# EAGLE design sensorHubRev4 (EAGLE 9.2.2)
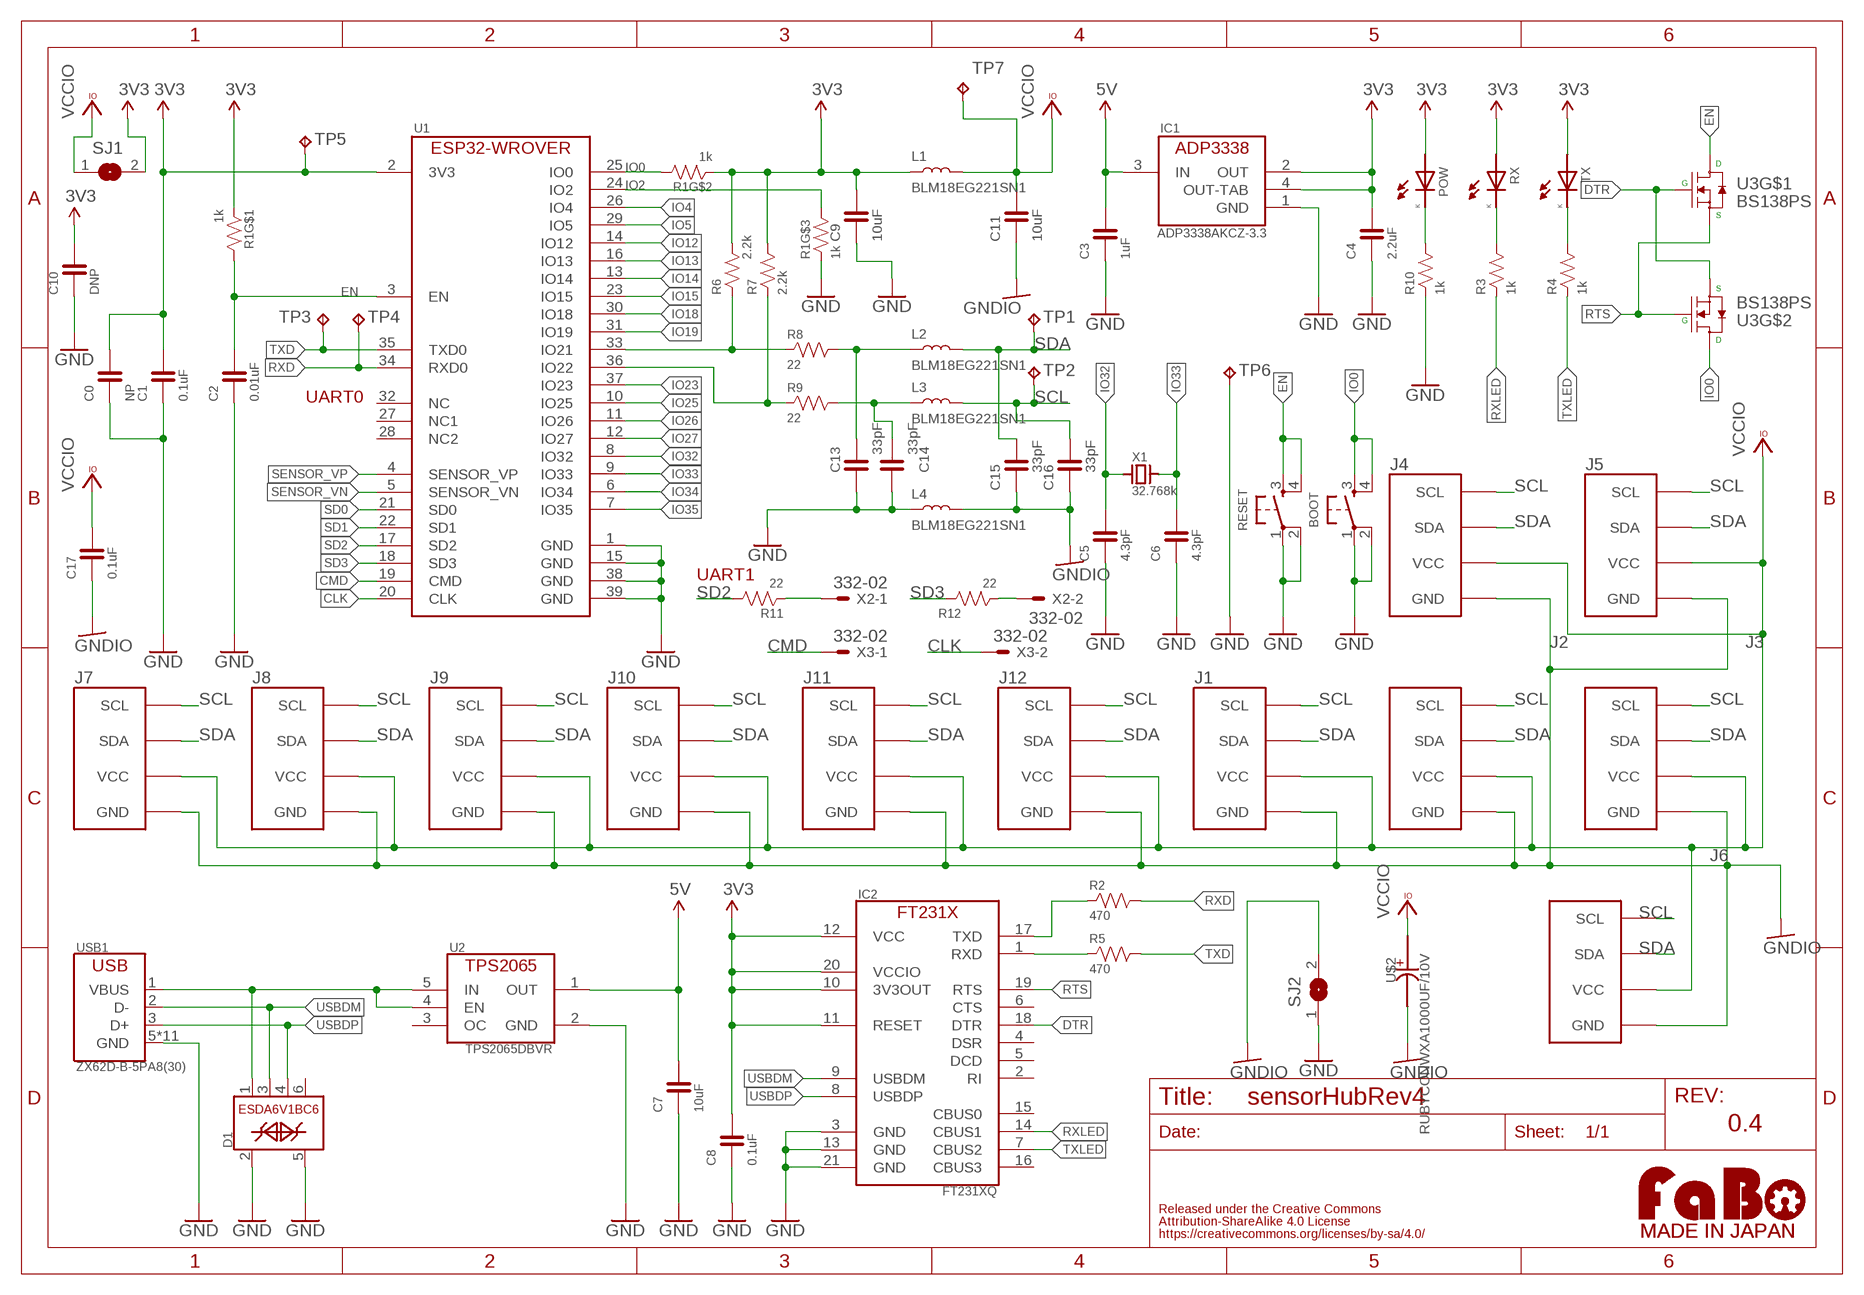
[diagram p0: schematic, sheet 1]

## Parts
BOOT  TACTILE-KMR2  [KMR2-TACT]
C0  NP  CAPACITOR-M  [MULTIPAD0603]
C1  0.1uF  CAPACITOR-0603  [EIA0603]
C2  0.01uF  CAPACITOR-0603  [EIA0603]
C3  1uF  CAPACITOR-0603  [EIA0603]
C4  2.2uF  CAPACITOR-0603  [EIA0603]
C5  4.3pF  CAPACITOR-0603  [EIA0603]
C6  4.3pF  CAPACITOR-0603  [EIA0603]
C7  10uF  CAPACITOR-0603  [EIA0603]
C8  0.1uF  CAPACITOR-0603  [EIA0603]
C9  10uF  CAPACITOR-0603_NARROW  [0603-NARROW]
C10  DNP  CAPACITOR-0603  [EIA0603]
C11  10uF  CAPACITOR-0603_NARROW  [0603-NARROW]
C13  33pF  CAPACITOR-0603_NARROW  [0603-NARROW]
C14  33pF  CAPACITOR-0603_NARROW  [0603-NARROW]
C15  33pF  CAPACITOR-0603_NARROW  [0603-NARROW]
C16  33pF  CAPACITOR-0603_NARROW  [0603-NARROW]
C17  0.1uF  CAPACITOR-0603  [EIA0603]
D1  ESDA6V1BC6  [SOT-23-6L]
IC1  ADP3338AKCZ-3.3  ADP3338AKCZ  [SOT-223-KC3]
IC2  FT231XQ  [QFN-20]
J1  FABO_BRICK_I2C-S04B-PASK-2  [FABO_BRICK_I2C_S04B-PASK-2]
J2  FABO_BRICK_I2C-S04B-PASK-2  [FABO_BRICK_I2C_S04B-PASK-2]
J3  FABO_BRICK_I2C-S04B-PASK-2  [FABO_BRICK_I2C_S04B-PASK-2]
J4  FABO_BRICK_I2C-S04B-PASK-2  [FABO_BRICK_I2C_S04B-PASK-2]
J5  FABO_BRICK_I2C-S04B-PASK-2  [FABO_BRICK_I2C_S04B-PASK-2]
J6  FABO_BRICK_I2C-S04B-PASK-2  [FABO_BRICK_I2C_S04B-PASK-2]
J7  FABO_BRICK_I2C-S04B-PASK-2  [FABO_BRICK_I2C_S04B-PASK-2]
J8  FABO_BRICK_I2C-S04B-PASK-2  [FABO_BRICK_I2C_S04B-PASK-2]
J9  FABO_BRICK_I2C-S04B-PASK-2  [FABO_BRICK_I2C_S04B-PASK-2]
J10  FABO_BRICK_I2C-S04B-PASK-2  [FABO_BRICK_I2C_S04B-PASK-2]
J11  FABO_BRICK_I2C-S04B-PASK-2  [FABO_BRICK_I2C_S04B-PASK-2]
J12  FABO_BRICK_I2C-S04B-PASK-2  [FABO_BRICK_I2C_S04B-PASK-2]
L1  BLM18EG221SN1  INDUCTOR-0603  [0603]
L2  BLM18EG221SN1  INDUCTOR-0603  [0603]
L3  BLM18EG221SN1  INDUCTOR-0603  [0603]
L4  BLM18EG221SN1  INDUCTOR-0603  [0603]
LOGO1  LOGO_FABO-M_BOTTOM  [LOGO_FABO_M_BOTTOM]
POW  LED-0603  [LED_0603]
R1  1k  RESISTOR_ARRAY  [EXBV8V]
R2  470  RESISTOR-0603  [EIA0603]
R3  1k  RESISTOR-0603  [EIA0603]
R4  1k  RESISTOR-0603  [EIA0603]
R5  470  RESISTOR-0603  [EIA0603]
R6  2.2k  RESISTOR-0603  [EIA0603]
R7  2.2k  RESISTOR-0603  [EIA0603]
R8  22  RESISTOR-0603  [EIA0603]
R9  22  RESISTOR-0603  [EIA0603]
R10  1k  RESISTOR-0603  [EIA0603]
R11  22  RESISTOR-0603  [EIA0603]
R12  22  RESISTOR-0603  [EIA0603]
RESET  TACTILE-KMR2  [KMR2-TACT]
RX  LED-0603  [LED_0603]
SJ1  SJ  [SJ]
SJ2  SJ  [SJ]
TP1  TPB1,27  [B1,27]
TP2  TPB1,27  [B1,27]
TP3  TPB1,27  [B1,27]
TP4  TPB1,27  [B1,27]
TP5  TPB1,27  [B1,27]
TP6  TPB1,27  [B1,27]
TP7  TPB1,27  [B1,27]
TX  LED-0603  [LED_0603]
U1  ESP32-WROVER-B  [ESP32-WROVER-B]
U2  TPS2065DBVR  TPS2065DBV  [SOT-23-5]
U3  BS138PS  [SOT-363]
U$2  RUBYCONWXA1000UF/10V  [ALUMINUM10*9]
USB1  ZX62D-B-5PA8(30)  USB-ZX62D  [ZX62D-B-5PA8]
X1  32.768k  CRYSTAL-ABS07  [ABS07]
X2  332-02  [332-02]
X3  332-02  [332-02]

## Nets
3V3: C0.2 C1.2 C4.2 C8.2 C9.2 C10.2 IC1.2(OUT) IC1.4(OUT-TAB) IC2.10(3V3OUT) IC2.11(RESET) IC2.12(VCC) IC2.20(VCCIO) L1.1 POW.A(ANODE) R1.1 R1.2 R6.2 R7.2 RX.A(ANODE) SJ1.2 TP5.TP TX.A(ANODE) U1.2(3V3)
5V: C3.2 C7.2 IC1.3(IN) U2.1(OUT)
CLK: U1.20(CLK) X3.2
CMD: U1.19(CMD) X3.1
DTR: IC2.18(DTR) U3.2(G) U3.4(S)
EN: C2.2 R1.8 RESET.3 RESET.4 U1.3(EN) U3.6(D)
GND: BOOT.1 BOOT.2 C0.1 C1.1 C2.1 C3.1 C4.1 C5.1 C6.1 C7.1 C8.1 C9.1 C10.1 C13.1 C14.1 D1.2 D1.5 IC1.1(GND) IC2.3(GND) IC2.13(GND) IC2.21(GND) L4.1 R1.3 R10.1 RESET.1 RESET.2 SJ2.1 TP6.TP U1.1(GND) U1.15(GND) U1.38(GND) U1.39(GND) U2.2(GND) USB1.5(GND) USB1.B1(GND) USB1.B2(GND) USB1.B3(GND) USB1.B4(GND) USB1.T1(GND) USB1.T2(GND) USB1.T3(GND) USB1.T4(GND) USB1.T5(GND) USB1.T6(GND)
GNDIO: C11.1 C15.1 C16.1 C17.1 J1.GND J2.GND J3.GND J4.GND J5.GND J6.GND J7.GND J8.GND J9.GND J10.GND J11.GND J12.GND L4.2 SJ2.2 U$2.MINUS(-)
IO0: BOOT.3 BOOT.4 R1.7 U1.25(IO0) U3.3(D)
IO2: R1.6 U1.24(IO2)
IO4: U1.26(IO4)
IO5: U1.29(IO5)
IO12: U1.14(IO12)
IO13: U1.16(IO13)
IO14: U1.13(IO14)
IO15: U1.23(IO15)
IO18: U1.30(IO18)
IO19: U1.31(IO19)
IO23: U1.37(IO23)
IO25: U1.10(IO25)
IO26: U1.11(IO26)
IO27: U1.12(IO27)
IO32: C5.2 U1.8(IO32) X1.1
IO33: C6.2 U1.9(IO33) X1.2
IO34: U1.6(IO34)
IO35: U1.7(IO35)
LED1K: POW.K(CATHODE) R10.2
LED2K1: R3.2 RX.K(CATHODE)
LED2K2: R4.2 TX.K(CATHODE)
N$1: IC2.1(RXD) R5.1
N$2: R11.1 X2.1
N$3: IC2.17(TXD) R2.1
N$4: R12.1 X2.2
N$5: R6.1 R8.1 U1.33(IO21)
N$6: R7.1 R9.1 U1.36(IO22)
N$7: C13.2 L2.1 R8.2
N$8: C14.2 L3.1 R9.2
RTS: IC2.19(RTS) U3.1(S) U3.5(G)
RXD: R2.2 TP4.TP U1.34(RXD0)
RXLED: IC2.14(CBUS1) R3.1
SCL: C16.2 J1.SCL J2.SCL J3.SCL J4.SCL J5.SCL J6.SCL J7.SCL J8.SCL J9.SCL J10.SCL J11.SCL J12.SCL L3.2 TP2.TP
SD0: U1.21(SD0)
SD1: U1.22(SD1)
SD2: R11.2 U1.17(SD2)
SD3: R12.2 U1.18(SD3)
SDA: C15.2 J1.SDA J2.SDA J3.SDA J4.SDA J5.SDA J6.SDA J7.SDA J8.SDA J9.SDA J10.SDA J11.SDA J12.SDA L2.2 TP1.TP
SENSOR_VN: U1.5(SENSOR_VN)
SENSOR_VP: U1.4(SENSOR_VP)
TXD: R5.2 TP3.TP U1.35(TXD0)
TXLED: IC2.7(CBUS2) R4.1
USBDM: D1.3 IC2.9(USBDM) USB1.2(D-)
USBDP: D1.4 IC2.8(USBDP) USB1.3(D+)
USBVBUS: D1.1 U2.4(EN) U2.5(IN) USB1.1(VBUS)
VCCIO: C11.2 C17.2 J1.VCC J2.VCC J3.VCC J4.VCC J5.VCC J6.VCC J7.VCC J8.VCC J9.VCC J10.VCC J11.VCC J12.VCC L1.2 SJ1.1 TP7.TP U$2.PLUS(+)
Unconnected: D1.6 IC2.2(RI) IC2.4(DSR) IC2.5(DCD) IC2.6(CTS) IC2.15(CBUS0) IC2.16(CBUS3) R1.4 R1.5 U1.27(NC1) U1.28(NC2) U1.32(NC) U2.3(OC)

## Notes on the sheet
- UART0
- UART1
- 0.4

## Library data of the parts
BOOT RESET = component:TACTILE
C0 C1-C8 C10 C17 = component:CAPACITOR
C9 C11 C13-C16 = FaBo-Capacitor:CAPACITOR: CAPACITOR
D1 = component:ESDA6V1BC6
IC1 = component:ADP3338AKCZ
IC2 = component:FT231X
J1-J12 = FaBo-Template:FABO_BRICK_I2C: FaBo Brick I2C
L1-L4 = FaBo-Inductor:INDUCTOR: RESISTOR
LOGO1 = component:LOGO_FABO
POW RX TX = component:LED
R1 = component:RESISTOR_ARRAY
R2-R12 = component:RESISTOR
SJ1 SJ2 = jumper:SJ: SMD solder JUMPER
TP1-TP7 = testpad:TP: Test pad
U1 = component:ESP32-WROVER-B
U2 = component:TPS2065
U3 = component:BS138PS
U$2 = FaBo-Capacitor:RUBYCONWXA1000UF/10V
USB1 = component:USB
X1 = component:CRYSTAL
X2 X3 = con-garry:332-02: 2 Pin - 2mm Dual Row Source: www.mpe-connector.de / garry_shortform_2012.pdf

## Board
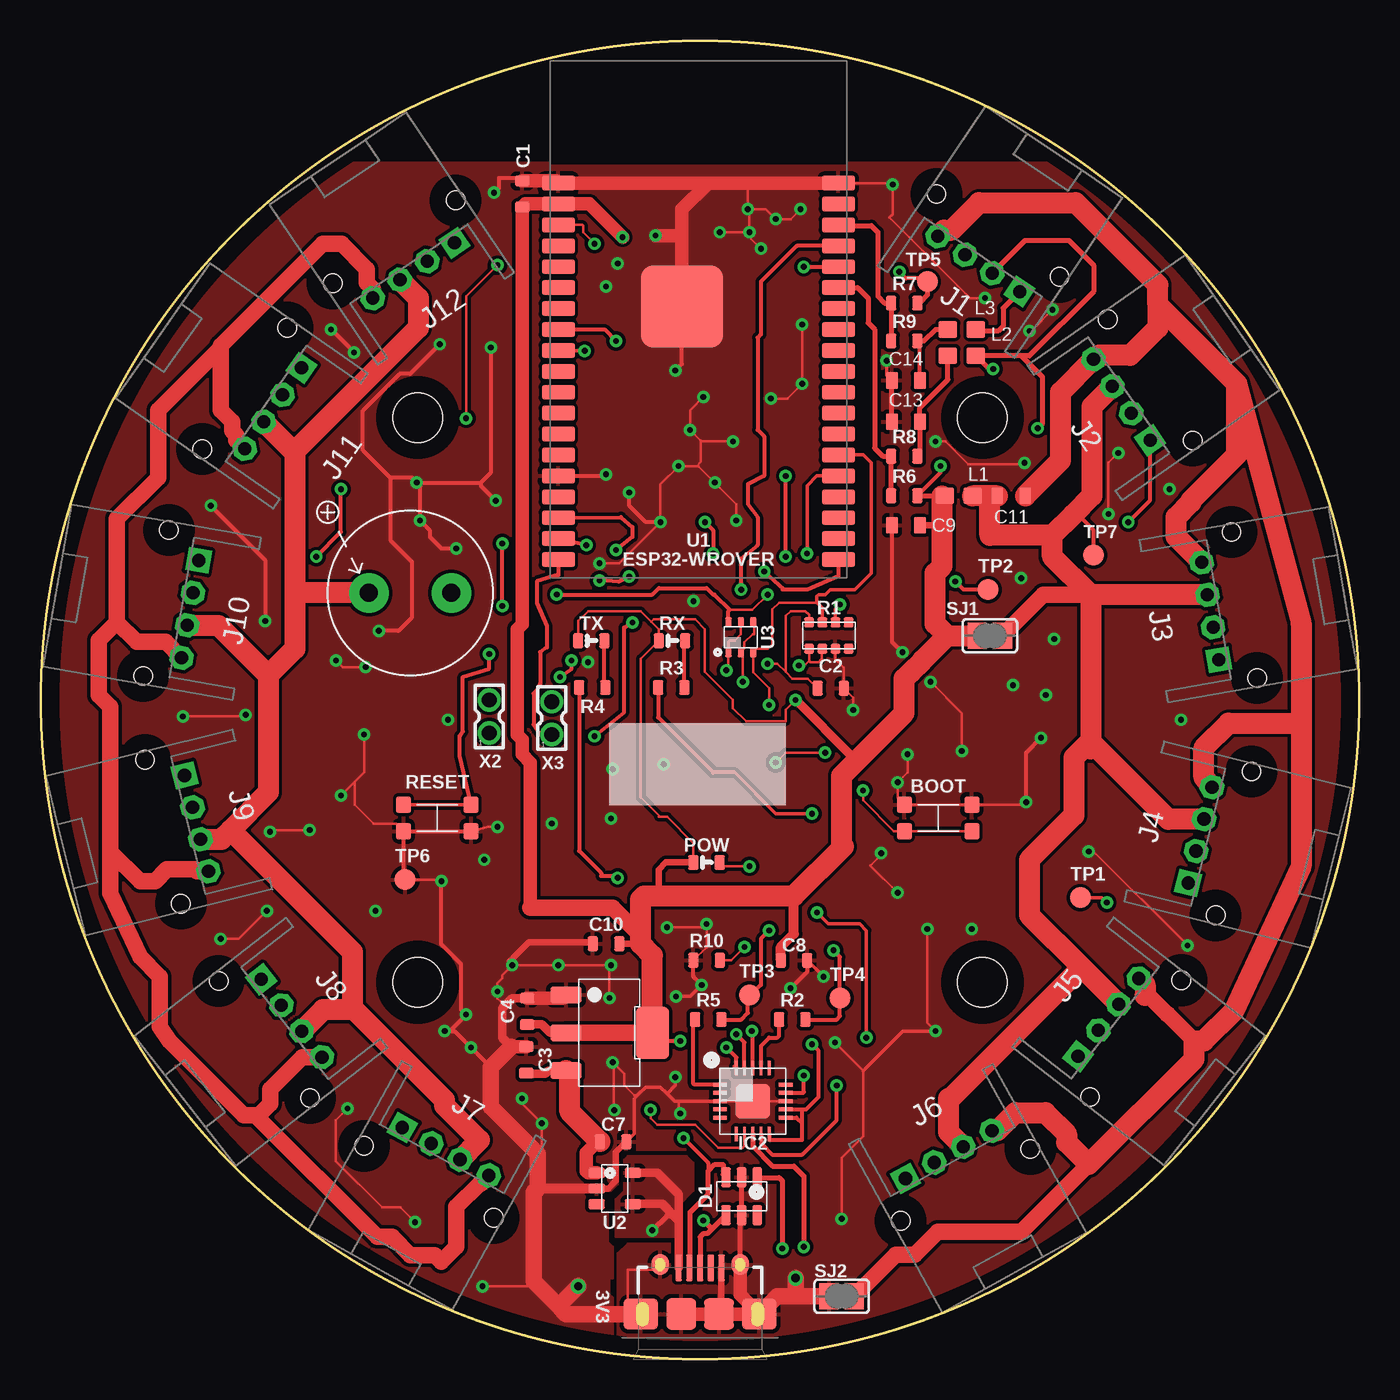
[diagram p1: board, top side]
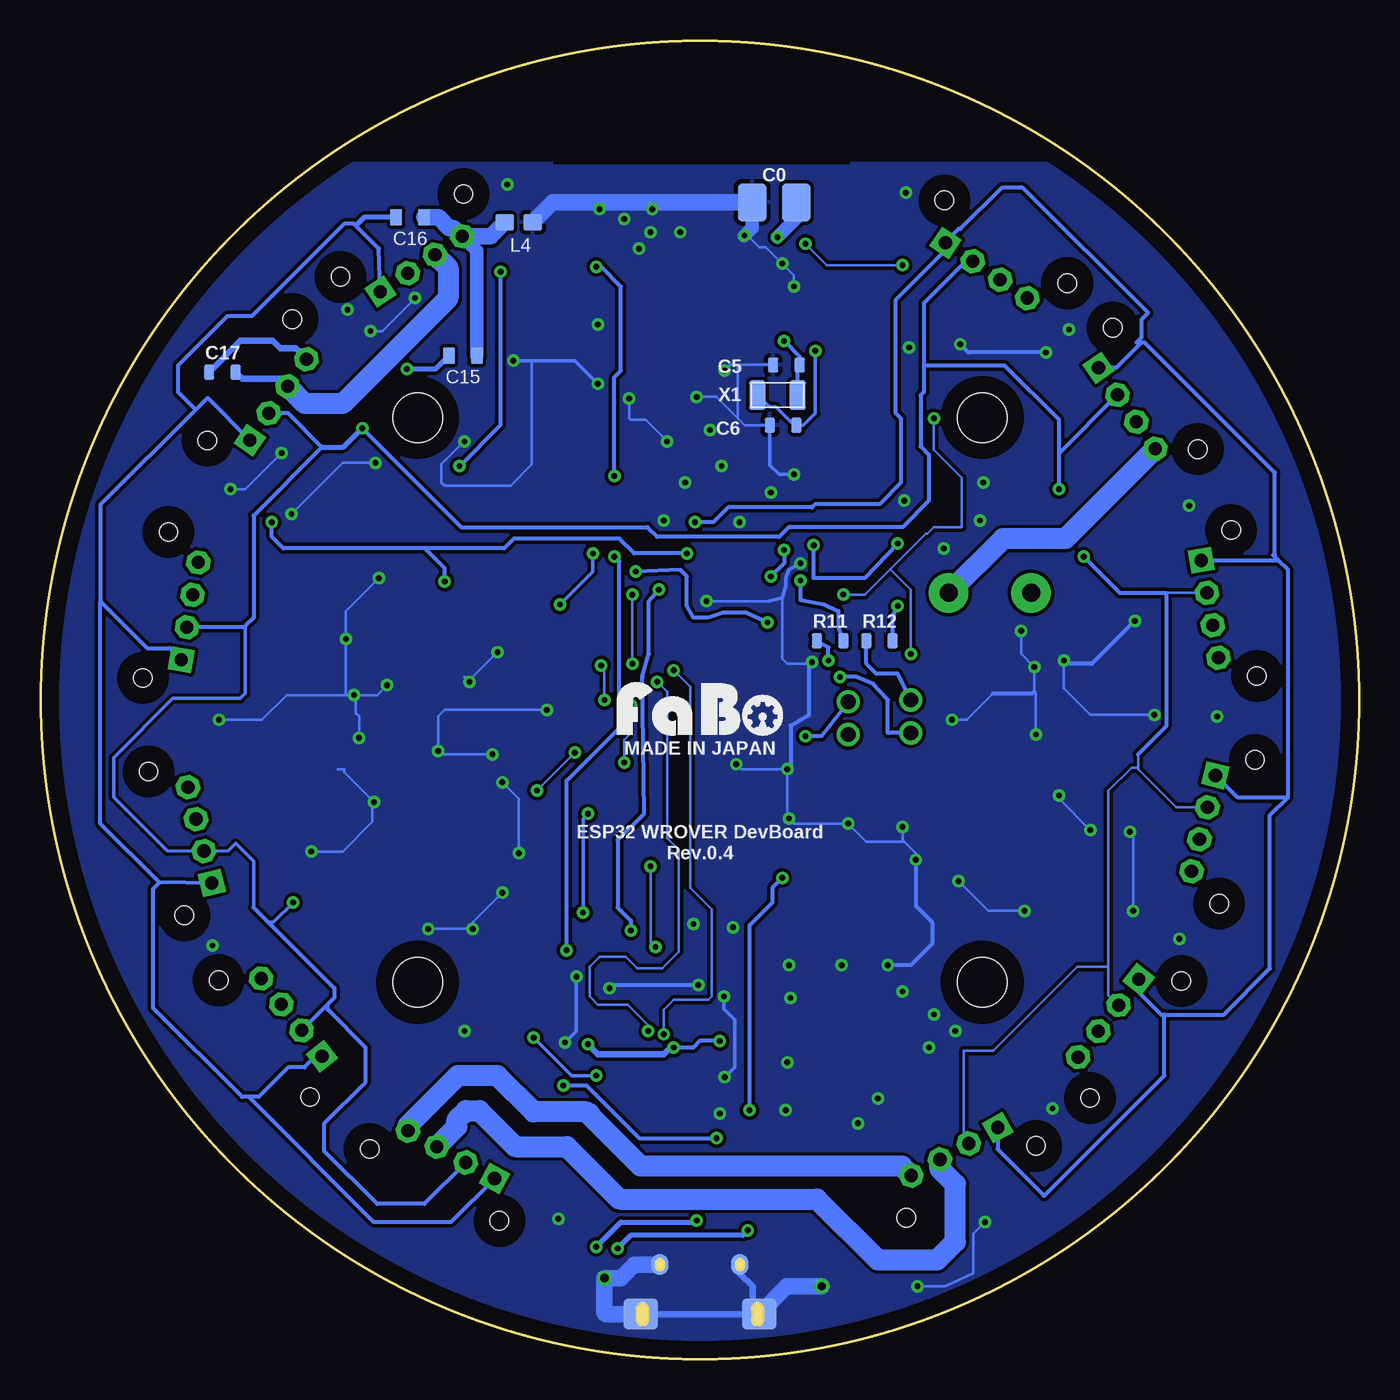
[diagram p2: board, bottom side, seen from below]

Size 80 x 80 mm. Coordinates in mm from the lower left corner, seen from the top.
Outline: circle at 40,40 radius 40
Copper layers (1*16): Top 0.035mm / dielectric 1.5mm / Bottom 0.035mm
Design rules "PCBway": minimum track width 6mil, minimum drill 0.3mm, track to track 0.205mm, track to pad 0.205mm, pad to pad 0.205mm, via to via 0.205mm, smd to smd 8mil, copper to edge 40mil, drill to drill 8mil, minimum pad ring 10mil, minimum via ring 8mil, stop-mask expansion 4mil, vias tented up to drill 25mil, thermal gap 10mil
Holes 3 mm at 22.86,57.15 22.86,22.86 57.15,22.86 57.15,57.15
tRestrict: area 15.5,72.7 to 65.1,83.6
bRestrict: area 15.5,72.7 to 65.1,83.6

### Footprints (pad centres in the part's own frame; a part is rotated, then mirrored left to right if it is on the bottom)
KMR2-TACT = smd 0.9 x 1: 1 -2.05,0.8; 2 2.05,0.8; 3 2.05,-0.8; 4 -2.05,-0.8
MULTIPAD0603 = smd 1.725 x 2.3: 1 -1.337,0; 2 1.337,0
EIA0603 = smd 0.65 x 0.9: 1 -0.8,0; 2 0.8,0
0603-NARROW = smd 0.71 x 1: 1 -0.85,0; 2 0.85,0
SOT-23-6L = smd 0.6 x 1.2: 1 -0.95,-1.15; 2 0,-1.15; 3 0.95,-1.15; 4 0.95,1.15; 5 0,1.15; 6 -0.95,1.15
SOT-223-KC3 = smd 1 x 1.9: 1 -2.3,-2.625; 2 0,-2.625; 3 2.3,-2.625 | smd 3.15 x 2: 4 0,2.625
QFN-20 = smd 0.9 x 0.25: 1 -2,1; 2 -2,0.5; 3 -2,0; 4 -2,-0.5; 5 -2,-1; 11 2,-1; 12 2,-0.5; 13 2,0; 14 2,0.5; 15 2,1 | smd 0.25 x 0.9: 6 -1,-2; 7 -0.5,-2; 8 0,-2; 9 0.5,-2; 10 1,-2; 16 1,2; 17 0.5,2; 18 0,2; 19 -0.5,2; 20 -1,2 | smd 2.1 x 2.1: 21 0,0
FABO_BRICK_I2C_S04B-PASK-2 = drill 0.8 pad 1.422 octagon: GND -3,0; SDA 1,0; VCC -1,0 | drill 0.8 pad 1.422 square: SCL 3,0 | hole 1.1: 4.5,2.1; -4.5,2.1
0603 = smd 1.1 x 1: 1 -0.85,0; 2 0.85,0
LED_0603 = smd 0.65 x 0.9: A -0.8,0; K 0.8,0
EXBV8V = smd 0.6 x 0.6: 1 -1.2,-0.8; 2 -0.4,-0.8; 3 0.4,-0.8; 4 1.2,-0.8; 5 1.2,0.8; 6 0.4,0.8; 7 -0.4,0.8; 8 -1.2,0.8
SJ = smd 1.168 x 1.6: 1 -0.762,0; 2 0.762,0
B1,27 = smd 1.27 x 1.27: TP 0,0
ESP32-WROVER-B = smd 2 x 0.9: 1 -8.5,8.26; 2 -8.5,6.99; 3 -8.5,5.72; 4 -8.5,4.45; 5 -8.5,3.18; 6 -8.5,1.91; 7 -8.5,0.64; 8 -8.5,-0.63; 9 -8.5,-1.9; 10 -8.5,-3.17; 11 -8.5,-4.44; 12 -8.5,-5.71; 13 -8.5,-6.98; 14 -8.5,-8.25; 15 -8.5,-9.52; 16 -8.5,-10.79; 17 -8.5,-12.06; 18 -8.5,-13.33; 19 -8.5,-14.6; 20 8.5,-14.6; 21 8.5,-13.33; 22 8.5,-12.06; 23 8.5,-10.79; 24 8.5,-9.52; 25 8.5,-8.25; 26 8.5,-6.98; 27 8.5,-5.71; 28 8.5,-4.44; 29 8.5,-3.17; 30 8.5,-1.9; 31 8.5,-0.63; 32 8.5,0.64; 33 8.5,1.91; 34 8.5,3.18; 35 8.5,4.45; 36 8.5,5.72; 37 8.5,6.99; 38 8.5,8.26 | smd 5 x 5: 39 -1,0.76
SOT-23-5 = smd 0.6 x 1: 1 -0.95,-1.1; 2 0,-1.1; 3 0.95,-1.1; 4 0.95,1.1; 5 -0.95,1.1
SOT-363 = smd 0.6 x 0.4: 1 -0.9,0.75; 2 -0.9,0; 3 -0.9,-0.75; 4 0.9,-0.75; 5 0.9,0; 6 0.9,0.75
ALUMINUM10*9 = drill 1.1 pad 2.4: MINUS 2.5,0; PLUS -2.5,0
ZX62D-B-5PA8 = smd 0.4 x 1.6: 1 -1.3,4.25; 2 -0.65,4.25; 3 0,4.25; 4 0.65,4.25; 5 1.3,4.25 | smd 1.05 x 1.25 bottom: B1 -2.425,4.45; B2 2.425,4.45 | smd 2.1 x 1.9 bottom: B3 -3.6,1.45; B4 3.6,1.45 | smd 1.05 x 1.25: T1 -2.425,4.45; T2 2.425,4.45 | smd 2.1 x 1.9: T3 -3.6,1.45; T6 3.6,1.45 | smd 1.8 x 1.9: T4 -1.15,1.45; T5 1.15,1.45
ABS07 = smd 1 x 1.8: 1 -1.225,0; 2 1.225,0
332-02 = drill 0.9 pad 1.27: 1 0,-1; 2 0,1

### Placement (x,y rotation side)
BOOT  54.46,32.84 0 top
C0  35.49,70.21 0 bottom
C1  29.21,70.72 270 top
C2  47.94,40.71 180 top
C3  29.45,18.15 270 top
C4  29.5,21.09 270 top
C5  34.76,60.34 0 bottom
C6  34.95,56.68 0 bottom
C7  34.73,13.18 180 top
C8  45.7,24.19 180 top
C9  52.5,50.6 0 top
C10  34.3,25.2 0 top
C11  58.9,52.4 180 top
C13  52.5,56.9 0 top
C14  52.5,59.4 0 top
C15  54.4,60.9 180 bottom
C16  57.6,69.3 180 bottom
C17  69,59.9 0 bottom
D1  42.53,9.88 180 top
IC1  34.49,19.8 270 top
IC2  43.2,15.64 0 top
J1  56.92,66.47 326 top
J2  65.61,58.23 305 top
J3  70.98,45.4 280 top
J4  70.36,31.8 256 top
J5  64.8,20.73 232 top
J6  55.1,12.4 209 top
J7  24.55,12.59 151 top
J8  15.2,20.68 128 top
J9  9.43,32.51 104 top
J10  9.04,45.52 80 top
J11  14.08,57.71 55 top
J12  22.61,66.08 34 top
L1  55.7,52.4 0 top
L2  55.9,60.9 0 top
L3  55.9,62.5 0 top
L4  51,69 180 bottom
LOGO1  40.01,37.47 0 top
POW  40.4,30.14 0 top
R1  47.83,43.91 0 top
R2  45.6,20.6 0 top
R3  38.26,40.76 0 top
R4  33.46,40.76 0 top
R5  40.5,20.6 0 top
R6  52.4,52.4 0 top
R7  52.4,64.1 0 top
R8  52.4,54.8 0 top
R9  52.4,61.8 0 top
R10  40.4,24.2 0 top
R11  32.1,43.6 0 bottom
R12  29.1,43.6 0 bottom
RESET  24.05,32.84 180 top
RX  38.3,43.6 0 top
SJ1  57.6,43.9 180 top
SJ2  48.6,3.8 0 top
TP1  63.1,28 0 top
TP2  57.5,46.7 0 top
TP3  43,22.1 0 top
TP4  48.5,21.9 0 top
TP5  53.8,65.4 0 top
TP6  22.1,29.1 0 top
TP7  63.9,48.8 0 top
TX  33.4,43.6 0 top
U1  39.91,63.12 0 top
U2  34.83,10.34 270 top
U3  42.48,43.81 90 top
U$2  22.4,46.5 0 top
USB1  40.01,1.27 0 top
X1  35.3,58.51 180 bottom
X2  27.2,39 0 top
X3  31,38.9 0 top

### Tracks (layer width: path | path; a pad name or v marks a point on that pad's centre or on a via)
3V3  (via drill 0.35)
  Top 0.152: POW.A 39.59,31.3 38,32.9 37.6,32.9 | 37.6,32.9 37.5,32.9 | 37.6,32.9 36.4,34.1 36.4,42.5 RX.A 37.5,44.3 37.05,44.75 | TX.A 32.6,44.8 33.2,45.4 36.4,45.4 37.05,44.75 | R1.1 46.62,42.38 | 46.62,42.38 46.7,42.3 47.2,42.3 47.4,42.5 47.4,43.09 R1.2 | 46.62,42.38 46.35,42.1 v46,42.1 | 37.05,44.75 37.2,44.9 39.7,44.9 40.3,44.3 40.3,41.7 42,40 42,39.5 42.8,38.7 45.2,38.7 45.2,39.4 v45.8,40
  Top 0.254: IC1.4 37.61,19.3 v38.8,19.3 | 42.1,17.75 IC2.20 42.2,18.3 v41.6,18.9 | IC2.12 46.3,15.14 | 46.3,15.14 46.45,15.14 47.2,15.9 47.2,18.7 v46.8,19.1 | IC2.10 44.2,13.3 46.2,13.3 46.2,14.3 | 46.2,14.3 46.2,15.04 46.3,15.14 | IC2.11 45.85,14.64 46.2,14.3 | R6.2 54.6,53.8 v54.6,54.2 | 54,65.6 52.5,65.6 v52.1,66
  Top 0.305: 54,65.6 TP5.TP 53.8,64.6 53.3,64.1 R7.2 | R6.2 54.7,52.4 L1.1 | 49.25,36.55 49.25,36.05
  Top 0.406: C9.2 54.7,50.6 | C8.2 45.01,24.19 | POW.A 37.94,30.14 37.5,29.7 37.5,28.1 | C10.2 36.4,25.2
  Top 0.508: IC1.2 30.91,19.8 30.4,20.3 C4.2 | v45.8,40 49.25,36.55 49.75,36.55
  Top 0.61: C8.2 44.91,25 45.7,25.8 45.7,28.1
  Top 0.813: v35.3,68.1 33.28,70.11 U1.2 29.41,70.11 C1.2 29.2,44.6 28.9,44.3 28.9,37.9 29.2,37.6 29.2,36.7 29.7,36.2 29.7,27.4
  Top 1.016: IC1.4 IC1.2 | 29.7,27.4 34.7,27.4 36.4,25.7
  Top 1.27: IC1.4 37.12,24.48 36.4,25.2 36.4,25.7 36.4,27.9 36.6,28.1 37.5,28.1 45.7,28.1 48.7,31.1 48.6,31.2 48.6,35.4 49.75,36.55 52.4,39.2 52.4,41.3 52.78,41.68 52.8,41.68 53.52,42.4 53.52,42.42 55,43.9 | 55,43.9 SJ1.2 | 54.7,52.4 54.7,50.6 54.7,48.12 54.28,47.7 54.28,44.62 55,43.9
  Bottom 0.152: v46,42.1 45.8,41.9 v45.8,40
  Bottom 0.254: v38.8,19.3 40,19.3 40.4,18.9 v41.6,18.9 | v54.6,54.2 52.1,56.7 v52.1,66
  Bottom 0.406: v41.6,18.9 41.8,18.9 42.2,18.5 46.2,18.5 v46.8,19.1
  Bottom 0.813: v35.3,68.1 34.16,69.24 C0.2
5V
  Top 0.508: 31.9,17.46 IC1.3 30.8,17.5 30.6,17.3 29.5,17.3 C3.2
  Top 0.813: 31.7,17.33 IC1.3 | U2.1 33.21,11.29 33.1,11.4 33.1,12.5 33.78,13.18 C7.2
  Top 1.27: C7.2 32.1,15.01 32.1,17.26 IC1.3
CLK  (via drill 0.35)
  Top 0.254: U1.20 48.4,47.5 46.5,46.7 45.1,46.7 | 45.1,46.7 45,46.7 | 45.1,46.7 v43.9,47.8 | v33.59,37.8 35.4,39.26 35.4,44.4 v35.9,44.7
  Bottom 0.254: X3.2 32.63,37.8 v33.59,37.8 | v35.9,44.7 37.2,45.3 38.6,45.3 39.5,45 40.4,45 40.8,45.7 40.8,47.5 41.2,47.9 v43.9,47.8
CMD
  Top 0.254: U1.19 31.4,47.6 30.1,47.2 30.1,45.9 30.7,44.5 30.7,43.2 30.3,42.9 30.3,41 30.1,40.6 29.9,40.4 29.9,38.5 30.3,37.9 X3.1
DTR  (via drill 0.35)
  Top 0.152: 43.2,19.84 v43.15,19.9 | v42.6,41.1 42.6,42.79 U3.2 42.7,43.13 42.7,43.5 43.2,44 43.3,44 43.3,44.64 U3.4
  Top 0.254: IC2.18 43.2,19.84
  Bottom 0.152: v43.15,19.9 43.15,20.25 44.4,21.5 46.2,21.5 46.7,22 46.7,23.8 46.1,24.4 44.5,24.4 43.8,23.7 42.3,23.7 41.3,24.7 41.3,30.9 42,31.6 42,40.5 v42.6,41.1
EN  (via drill 0.35)
  Top 0.152: v25.8,57.1 25.8,64.5 v27.7,66.4 | v33.6,67.7 32.9,68.4 32.9,68.8 32.85,68.84 U1.3 | C2.2 46.55,41.3 45.6,41.3 45.2,41.7 | R1.8 46.62,45.17 46.4,45.4 45.5,45.4 45.2,45.1 45.2,41.7 | 45.2,41.7 44.7,42.2 v44.1,42.2 | v44.11,46.39 43.18,45.47 41.8,45.47 41.73,45.47
  Top 0.203: RESET.3 RESET.4
  Top 0.254: RESET.4 25.4,36.6 25.4,37.8 25.6,38.1 25.6,41.4 27.2,41.9 v27.2,42.8 | v31.3,46.4 37.1,46.4 37.5,46.8 40.4,46.8 40.8,46.4 40.87,46.4 41.8,45.47 41.73,45.4 U3.6
  Bottom 0.152: v31.3,46.4 30,46.4 28.45,47.95 | v25.8,57.1 25.8,55.2 24.1,53.5 24.1,50.5 25.8,50.5 26.2,50.1 26.3,50.1 28.45,47.95 | v27.7,66.4 32.3,66.4 v33.6,67.7 | v27.2,42.8 27.2,46.7 28.45,47.95 | v44.1,42.2 v44.1,46.39 v44.11,46.39
GND  (via drill 0.35, 0.5)
  Top 0.152: v59.8,33.8 59.65,33.65 BOOT.2 BOOT.1 52,34.05 v52,35 52.6,35.6 v52.6,36.7 | R1.3 48.23,42.48 48.74,41.96 C2.1 49.3,40.15 v49.3,39.4 | v19.6,37.9 19.6,35.6 19.05,35.05 | USB1.T3 35.6,3.52 35.6,5.4 37.26,5.4 USB1.T1 | IC2.3 IC2.21 IC2.13 | v41.2,68.4 v43,68.4 | v43,68.4 43,69.7 v42.9,69.8 | v42.9,69.8 42.9,71.39 | v42.9,69.8 44,69.8 v44.6,69.2 45.5,69.2 v46.1,69.8 | v43,68.4 43,68.1 v43.7,67.4 | v46.2,62.8 v46.2,59.2 45.3,58.3 v44.3,58.3 | v42,55.7 40.1,55.7 40.05,55.75 | 40.05,55.75 v39.4,56.4 39.4,57.6 v40.2,58.4 | 39.8,54.2 v38.7,54.2 37.6,53.1 v37.6,50.8 35.1,48.3 v33.9,48.3 | 39.8,54.2 39.9,54.2 v40.9,53.2 42.2,51.9 v42.2,50.9 | 39.8,54.2 40.05,54.45 40.05,55.75 | RESET.1 27.14,32.3 v27.7,32.3 | v24.3,29 24.2,29.1 TP6.TP | v18.2,34.2 19.05,35.05 | v17.9,42.4 18.3,42 v19.7,42 | v52,28.3 50.35,29.95 51,30.6 v51,30.7 | R10.1 40.4,25 v40.4,26.4 40.2,26.2 v38,26.2 | v34.5,21.9 34.5,23.8 v34.6,23.9 v31.4,23.9 v28.6,23.9 28.45,23.75 28,23.3 28,23.1 27.7,22.8 v27.7,22.3 27.7,21.9 28,21.6 28,21.3 | v34.7,18 34.75,17.95 | 34.75,17.95 35.4,17.3 35.4,16.6 36,16 36.2,16 | v34.8,15.1 34.75,15.15 34.75,17.95 | v29.2,15.8 29.2,15.5 v30.4,14.3 30.4,10.34 | v48.2,19.2 49.9,17.5 49.9,13.5 48.6,12.2 v48.6,8.5 | v54.3,19.9 53.8,20.4 v53.8,26.1 | v38.8,14.9 38.7,15 38.7,15.64 | v54,41.1 55.9,39.2 v55.9,36.9 | U1.38 51.62,71.39 v51.7,71.3 51.7,69.5 51.5,69.3 56.4,64.4 v57.3,64.4 | v61.4,63.7 60.1,62.4 v60,62.4 | v65.4,55 64.8,54.4 v64.8,51.3 | v59.7,54.4 59.6,54.3 56.3,54.3 54.9,55.7 v54.3,55.7 | v69.6,25.1 63.9,30.8 v63.6,30.8 | v18.6,15.2 17.9,14.5 17.9,12 20.7,9.2 21.8,9.2 v22.7,8.3 | v26.8,4.4 29.6,4.4 29.9,4.7
  Top 0.152: v10.9,25.5 12,25.5 v13.7,27.2 | v13.9,32 14,32.1 v16.3,32.1 | v8.6,39 12.31,39 v12.41,39.1 | RESET.2 21.55,32.5 20.2,32.5 19.05,33.65 19.05,35.05
  Top 0.203: C7.1 36,13.65 36,15.8 36.2,16 36.7,16.5 37.6,16.5 38,16.1 | IC2.3 38.7,15.64 38.45,15.64 38,16.1 | v40.1,22.7 39.4,22 v38.54,22 | v38.5,17.1 38.5,16.6 38,16.1 | v47.5,23.2 46.6,24.1 46.51,24.1 | 49.9,17.5 52.3,19.9 v54.3,19.9 | C14.1 51.34,59.71 v51.34,60.6
  Top 0.254: U1.15 34.2,53.6 v34.3,53.7 | v38.5,60 38.91,60.41 U1.39 | 30.82,71.39 U1.1 | TP6.TP 22,29.2 RESET.2 RESET.1 | USB1.T2 42.73,5.42 | C8.1 46.51,24.1 46.51,23.5 v45.5,22.5 | v40.1,22.7 39.6,23.2 R10.1 | v59.8,33.8 59.8,36.8 v60.7,37.7 | v52.3,42.9 51.65,43.55 C9.1 | v10.3,51.8 13.6,48.5 v13.6,44.8 | v17.6,62.5 v19,61.1 | v24.2,61.6 22.39,59.79 21.77,59.79 19.5,57.53 19.5,55.2 21.2,53.5 | 21.2,53.5 21.2,49.7 22.5,48.4 22.5,45 21.7,44.2 v20.5,44.2 | 27.3,17.7 v26.1,18.9 25.1,19.9 v24.5,19.9 24.8,19.9 v25.8,20.9 25.5,21.2 25.5,23.95 24.3,25.16 v24.3,29 | v22.8,53.2 23,53 v23,50.9 23.6,50.3 23.6,49.9 24.3,49.2 v25.2,49.2 | v22.8,53.2 22.5,53.5 21.2,53.5 | v22.8,53.2 26.7,53.2 | 26.7,53.2 26.7,53 v27.6,52.1 | v27.3,61.4 27.3,53.8 26.7,53.2 | v37.6,50.8 36.7,50.8 35.7,51.8 v35.7,52.6 | v27.5,70.8 27.8,71.1 27.8,71.7 29.03,71.7 C1.1
  Top 0.305: C13.1 C14.1 | D1.2 D1.5 42.43,8.63 USB1.T2
  Top 0.406: USB1.5 41.3,2.87 USB1.T5 | U2.2 34.44,10.34 34.9,10.8 34.9,12.55 C7.1 | USB1.T3 36.41,2.91 | C10.1 33.4,25.3 29.6,25.3 28.45,24.15 28.45,23.75
  Top 0.508: 28.55,18.95 28,19.5 28,21.3 28.6,21.9 28.61,21.89 C4.1
  Top 0.61: U2.2 30.4,10.34 30.14,10.34
  Top 0.813: C1.1 31.27,71.52 U1.1 40.5,71.39 | IC1.1 31.66,21.89 C4.1 | C3.1 28.55,18.95 | U1.38 42.9,71.39 40.5,71.39 | U1.39 38.91,68.2 | 38.91,68.2 38.91,69.79 40.5,71.39 | v37.3,68.2 38.91,68.2 | USB1.T4 USB1.T5 USB1.T6 42.43,3.9 USB1.T2
  Top 1.016: SJ2.1 45.8,3.8 | 45.8,3.8 44.69,3.8 USB1.T6 | 28.55,18.95 27.3,17.7 27.3,15.3 30.14,12.46 30.14,10.34 29.9,10.1 29.9,4.7 31.45,3.15 | USB1.T3 31.88,2.72 31.45,3.15 | v32.6,4.4 31.45,3.25 31.45,3.15 | v45.8,4.9 45.8,3.8
  Bottom 0.152: v59.8,33.8 59.9,33.9 | 59.9,33.9 61.6,35.6 61.6,35.8 62,35.8 | v49.3,39.4 55.5,39.4 55.9,39 v55.9,36.9 55.7,36.7 v52.6,36.7 | v19.6,37.9 19.6,40.4 19.7,40.5 v19.7,42 20.5,42.8 v20.5,44.2 | C5.1 37.56,60.34 | C6.1 37.28,56.68 37.7,57.1 | 37.56,60.34 37.7,60.2 37.7,57.1 | 37.7,57.1 39,58.4 v40.2,58.4 | v34.3,65.1 34.3,65.8 v35,66.5 36,67.5 36.4,67.5 37.1,68.2 v37.3,68.2 | v42,55.7 43.3,57 44.2,57 44.3,57.1 v44.3,58.3 | v39.6,46 35.87,46 | v37.8,36.1 37.5,35.8 v34.7,35.8 34.7,35.7 34.7,32.9 v34.6,32.8 34.3,32.5 v31,32.5 29.9,31.4 27.7,31.4 | 27.7,31.4 27.6,31.4 26.9,30.7 v26.9,30.3 | v27.7,32.3 27.7,31.4 | v20.3,27.2 22.5,27.2 v24.3,29 | v52,35 51,34 v51,30.7 | v59,40.9 59.6,40.3 60.9,40.3 | 60.9,40.3 v61,40.3 61.5,40.3 | v60.7,37.7 60.7,39 60.9,39.2 60.9,40.3 | 61.5,40.3 v61.5,43.7 61.5,45.4 v59.5,47.4 | v52.3,42.9 54,41.2 v54,41.1 54.3,41.4 | v52,28.3 53.8,26.5 v53.8,26.1 v56.5,26.1 | 22.2,40.4 23.8,38.8 v24.7,38.8 | 37.56,60.34 38.16,60.34 v38.5,60 | 35,46.2 35,42.5 34.7,42.2 33.3,42.2 | v60,62.4 59.3,62.4 v57.3,64.4 | v68.5,52.8 67.6,52.8 v65.4,55 | v64.8,51.3 61.7,54.4 v59.7,54.4 | v54.3,55.7 55.7,54.3 55.7,53.2 55.5,53 51.5,53 50.2,54.3 50.2,60.6 | v69.2,38.8 66.6,38.8 65.1,40.3 61.5,40.3 | v63.6,30.8 61.7,30.8 59.9,32.6 59.9,33.9 | v22.7,8.3 23.4,7.6 23.4,5.2 25.12,4.4 v26.8,4.4 | v13.7,27.2 13.7,31.8 v13.9,32 | v16.3,32.1 18.2,34 v18.2,34.2 | v12.41,39.1 16.3,39.1 17.9,40.7 17.9,42.2 v17.9,42.4
  Bottom 0.203: C6.1 35.76,54.26 35.2,53.7 v34.3,53.7 | v38.54,22 38.54,21.24 37.9,20.6 37.9,17.7 v38.5,17.1 | 35.87,46 35,46.2 34.8,46.9 34.8,47.4 34.6,47.9 v33.9,48.3 | v48.2,19.2 47.5,19.9 v47.5,23.2 | v51.34,60.6 50.2,60.6 47.6,60.6 v46.2,59.2
  Bottom 0.254: v45.5,22.5 45.3,22.7 v40.1,22.7 | v33.2,42.3 33.3,42.2 33.4,42.1 33.4,39.07 34.5,38.44 34.5,35.83 34.7,35.7 | 22.2,40.4 19.8,40.4 19.7,40.5 | v26.9,30.3 26.9,27.5 25.9,26.5 25.9,25.2 27.2,23.9 v28.6,23.9 | v13.6,44.8 16.2,42.2 17.9,42.2 | v19,61.1 23.7,61.1 v24.2,61.6
  Bottom 0.406: USB1.T6 USB1.T3 36.8,3.12 36.8,4.4 37.58,5.18 USB1.T1
  Bottom 0.813: C0.1 36.83,68.67 v37.3,68.2
  Bottom 1.016: L4.1 48.94,70.21 C0.1 | USB1.T3 34.73,4.4 v32.6,4.4 | USB1.T2 43.98,5.72 44.8,4.9 v45.8,4.9 45.8,2.8 45.7,2.7 45.68,2.72 USB1.T6
  pour Bottom (rank 2, no thermals): 34.92,1.27 34.92,4.45 36.2,4.45 36.2,6.99 43.81,6.99 43.81,4.45 45.09,4.45 45.09,1.27
  pour Top (rank 2, no thermals): 41.2,17.65 45.21,17.65 45.21,13.64 41.2,13.64
  pour Top (rank 2, no thermals): 41.78,66.68 41.78,60.99 36.09,60.99 36.09,66.68
  pour Bottom: 0,0 0,80.01 81.28,80.01 81.28,0
  pour Top: 35,1.3 35,4.4 36.2,4.4 36.2,6.9 43.8,6.9 43.8,4.5 43.9,4.4 45.1,4.4 45.1,1.3
  pour Top: 0,80 81.2,80 81.2,0 35,0 35,6.4 35.6,7 39,7 39.3,7.3 39.3,9.3 40.1,10.1 40.1,12.2 39.6,12.7 35.1,12.7 35,12.6 35,10.6 34.4,10 34.4,7.1 34.7,6.8 34.7,4.9 34.5,4.9 34.5,3.9 34.7,3.7 34.7,0.7 34.1,0.1 0,0.1
GNDIO
  Top 1.016: J12.GND 20.12,64.98 19.78,65.32 19.78,66.16 18.24,67.7 17.11,67.7 10.9,61.49 10.9,61.4 | J11.GND 11.85,55.76 11.85,56.09 11.6,56.34 11.6,56.9 10.9,57.6 10.9,61.4 | J10.GND 7.56,43.53 5.8,43.53 4.6,44.73 | 4.6,44.73 4.6,51 7.1,53.5 7.1,57.6 10.9,61.4 | J9.GND 9.45,29.6 9.34,29.71 7.62,29.71 6.91,29 6,29 4.2,30.8 | 4.6,44.73 3.5,43.63 3.5,40.3 4.2,39.6 4.2,30.8 | J8.GND 15.86,18.32 13.9,16.36 13.9,15.5 13.2,14.8 13,14.8 | 4.2,30.8 4.2,28.26 6,24.4 7.2,23.2 7.2,20.15 7.78,19.32 12.3,14.8 13,14.8 | J7.GND 26.69,10.64 26.61,10.64 25.2,9.23 25.2,6.8 24.3,5.9 23.9,6.3 22.4,6.3 21.3,7.4 20.4,7.4 13,14.8 | SJ2.2 51.87,6.31 53.04,6.31 54.43,7.7 59.5,7.7 63.6,11.8 | 67.02,22.07 67.2,22.07 68.37,20.91 68.39,20.91 70,19.3
  Top 1.27: C11.1 61.9,54.55 61.9,58.7 J2.GND 64.12,60.92 66.12,60.92 67.8,62.6 67.8,64 | J1.GND 54.81,68.53 55.27,68.53 56.95,70.2 62.8,70.2 67.8,65.2 67.8,64 | J4.GND 70.6,35.31 70.6,37.1 72.1,38.6 76.5,38.6 | J3.GND 68.9,49.91 68.9,51.1 69.8,52 69.8,52.1 72.6,54.9 72.6,59.2 | 72.6,59.2 67.8,64 | 72.6,59.2 76.5,44.65 76.5,38.6 | J5.GND 67.02,22.72 67.02,22.07 | 76.5,38.6 76.5,29.89 72.4,21.1 70.6,19.3 70,19.3 70,18.2 63.6,11.8 62.26,13.14 62.26,13.66 60.97,14.95 59.14,14.95 58.05,13.85 J6.GND
  Bottom 0.406: C17.1 67.9,61.8 65.93,61.8 65.48,61.35 64.55,61.35 J2.GND
  Bottom 0.813: C15.1 53.55,67.27 J1.GND
  Bottom 1.016: L4.2 52.7,68.15 J1.GND 54.94,68.65 55.22,68.65 55.87,69.3 C16.1
  Bottom 1.27: J7.GND 27.75,11.7 43.6,11.7 46.7,14.8 | 46.7,14.8 46.7,14.9 | 46.7,14.8 46.9,15 50.1,15 52.3,17.2 54.7,17.2 57.72,14.18 J6.GND | U$2.MINUS 21.6,49.8 17.81,49.8 J11.GND
IO0  (via drill 0.35)
  Top 0.152: BOOT.3 BOOT.4 51.76,32.05 49.9,33.9 v49.9,34.5 | 47.12,45.9 47.1,45.9 44.8,45.9 44.4,45.5 44.4,43.4 44.1,43.1 43.42,43.1 U3.3 43.23,41.67 44.19,40.71 v44.19,39.7 | v47.6,36.8 45.2,36.8 v44.6,36.2
  Top 0.203: U1.25 49.92,54.88 50.4,54.4 50.4,47.7 49.4,46.7 47.9,46.7 47.6,46.4 47.2,46.4 47.1,46.3 47.1,45.9 | R1.7 47.42,45.6 47.12,45.9
  Bottom 0.152: v49.9,34.5 v47.6,36.8 | v44.6,36.2 44.6,37.6 44.3,37.9 44.3,39.59 v44.19,39.7
IO2  (via drill 0.35)
  Top 0.203: R1.6 48.23,45.52 v48.5,45.8 | v46.5,48.9 46.5,53 47.1,53.6 U1.24
  Bottom 0.203: v48.5,45.8 46.5,47.8 v46.5,48.9
IO32  (via drill 0.35)
  Top 0.254: U1.8 34.2,62.49 v34.9,61.8
  Bottom 0.254: X1.1 34.07,60.23 C5.2 33.95,60.85 v34.9,61.8
IO33  (via drill 0.35)
  Top 0.203: v33,61.2 31.43,61.2 U1.9
  Bottom 0.203: X1.2 35.81,57.8 35.4,57.8 34.28,56.68 C6.2 33.72,56.68 33,57.4 v33,61.2
LED1K  (via drill 0.35)
  Top 0.152: v43,29.9 41.43,29.9 POW.K | v42.7,25 41.9,24.2 R10.2
  Bottom 0.152: v43,29.9 43,25.3 v42.7,25
LED2K1
  Top 0.254: R3.2 39.05,43.55 RX.K
LED2K2
  Top 0.254: R4.2 34.2,40.82 TX.K
N$1
  Top 0.152: IC2.1 41.2,16.6
  Top 0.254: IC2.1 39.66,16.64 39.6,16.7 39.6,20.5 R5.1
N$2  (via drill 0.35)
  Top 0.254: v31.5,41.4 32.2,41.9 v32.2,42.4
  Bottom 0.254: X2.1 28.6,38 28.6,40 29.5,41 30.5,41.4 v31.5,41.4 | v32.2,42.4 32.2,43.2 R11.1
N$3
  Top 0.254: IC2.17 43.7,19 44.2,19.5 44.7,19.5 44.8,19.6 R2.1
N$4
  Bottom 0.254: X2.2 28,41.6 29.3,41.6 29.9,42.2 R12.1
N$5
  Top 0.305: 48.44,65 U1.33 49.56,65.03 50.2,64.4 50.2,62.9 50.6,62.5 50.6,55.3 51.1,54.8 R8.1 R6.1
N$6
  Top 0.152: R7.1 51.4,64.1
  Top 0.305: U1.36 48.45,68.8 50.4,68.8 50.8,68.4 50.8,64.5 51.2,64.1 R7.1 R9.1
N$7
  Top 0.305: L2.1 55.05,59.45 53.35,57.75 C13.2 53.35,54.95 R8.2
N$8
  Top 0.254: C14.2 53.35,61.65 R9.2
  Top 0.305: R9.2 53.6,61.8 54.3,62.5 L3.1
RTS  (via drill 0.35)
  Top 0.152: v42.21,19.7 v42.2,19.71 | v41.6,41.8 41.73,41.93 U3.1 41.73,43.53 41.8,43.6 42.1,43.6 42.48,43.98 U3.5
  Top 0.254: IC2.19 42.7,19.21 v42.21,19.7
  Bottom 0.152: v42.2,19.71 42.2,21.2 41.6,21.8 39.5,21.8 39.3,22 39.3,27.3 40.6,28.6 40.6,40.8 v41.6,41.8
RXD  (via drill 0.35)
  Top 0.254: R2.2 48.3,20.6 48.5,20.8 TP4.TP 48.5,24.4 v48.1,24.8 | v45.2,48.7 v45.2,53.6 | v46.3,66.3 U1.34
  Bottom 0.254: v48.1,24.8 48.1,35.1 44.9,38.3 44.9,48.4 v45.2,48.7 | v45.2,53.6 45.2,59.6 44.8,60 44.8,65.1 46,66.3 v46.3,66.3
RXLED  (via drill 0.35)
  Top 0.203: 40.8,35.6 42.1,35.6 44.6,33.1 v46.8,33.1 | v47.1,27.1 47.8,26.4 49.7,26.4 50.1,26 v50.1,19.5
  Top 0.254: IC2.14 46.24,16.14 46.3,16.2 v46.3,17.2 | R3.1 37.45,38.95 40.8,35.6
  Bottom 0.203: v46.8,33.1 47.1,32.8 v47.1,27.1 | v46.3,17.2 47.8,17.2 v50.1,19.5
SCL  (via drill 0.35)
  Top 0.254: v66,50.8 67.33,52.13 J2.SCL | v40.3,50.8 40.8,50.3 v40.8,48.9 | TP2.TP 56,46.7 v55.5,47.2
  Top 0.305: J1.SCL 58.4,63.78 58.4,62.7 58.1,62.4 56.85,62.4 L3.2
  Bottom 0.254: 13.2,61.7 14.73,60.17 J11.SCL | J10.SCL 9.54,48.5 4.9,48.5 | 13.2,61.7 13,61.7 5.1,53.8 5.1,48.8 5.2,48.8 4.9,48.5 | 13.2,61.7 13.5,61.7 13.2,62 13.2,63.1 12.8,63.5 20.4,71.1 21.69,71.1 24.19,68.6 24.3,68.6 25.1,67.8 J12.SCL 25.1,67.3 28.1,64.3 28.1,57.4 27.8,57.1 27.8,53.2 29.1,51.9 33,51.9 33.2,51.7 38.3,51.7 39.2,50.8 v40.3,50.8 | J9.SCL 7.38,34.1 4.3,34.1 | 4.3,34.1 4.3,47.9 4.9,48.5 | J8.SCL 13.35,22.95 13.7,22.6 12,20.9 11.8,20.9 | 11.8,20.9 8.2,20.9 5.4,23.7 5.4,33 4.3,34.1 | J7.SCL 21.93,12.73 19.1,9.9 11.8,17.2 11.8,20.9 | J2.SCL 69.9,58.34 70.52,57.72 | J3.SCL 72.2,43.15 73.55,43.15 76.4,46 | 70.52,57.72 76.4,51.84 76.4,46 | J4.SCL 72.8,28.93 | 72.8,28.93 72.83,28.93 76.4,32.5 76.4,46 | J5.SCL 63.35,18.37 64.02,17.7 65,17.7 66.8,15.9 67.4,15.9 | 72.8,28.93 73.2,28.53 73.2,21.3 67.8,15.9 67.4,15.9 | J6.SCL 55.12,8.3 59.8,8.3 67.4,15.9 | J1.SCL 59.5,67.4 60.9,68.8 61,68.9 61.6,68.9 67.2,63.3 68.7,63.3 71.7,60.3 71.7,58.7 70.72,57.72 70.52,57.72 | v66,50.8 66,49.9 65.3,49.2 56.7,49.2 | v40.8,48.9 44,48.9 44.9,49.8 51.3,49.8 51.9,49.2 56.7,49.2 | 56.7,49.2 55.5,48 v55.5,47.2
  Bottom 0.305: C16.2 60.4,69.3 60.9,68.8
SD2  (via drill 0.35)
  Top 0.254: U1.17 35.2,51.1 35.9,50.5 35.9,49.9 v34.9,49.1 | v35.7,47.5 35.07,47.18 v33.9,47.26
  Bottom 0.254: v34.9,49.1 34.9,48.3 v35.7,47.5 | v33.9,47.26 33.9,46.08 32.5,45.8 31.6,45.4 31.6,44.4 R11.2
SD3  (via drill 0.35)
  Top 0.254: v28,45.7 v28,49.5 | v33.1,49.4 U1.18
  Bottom 0.254: R12.2 28.3,45.1 v28,45.7 | v28,49.5 30,47.4 33.1,47.4 v33.1,49.4
SDA  (via drill 0.35)
  Top 0.203: TP1.TP 64.4,28 v64.7,27.7
  Top 0.254: v16.7,48.7 18.2,50.2 v18.2,52.8
  Top 0.305: J1.SDA 59.74,67.9 62.4,67.9 63.9,66.4 63.9,64.8 60,60.9 59.5,60.9 | 59.5,60.9 L2.2 57.55,60.1 v57.8,60.1 | v60.5,56.5 60.8,56.8 60.8,59.6 59.5,60.9
  Bottom 0.152: 15.48,57.7 J11.SDA | J10.SDA 11.71,46.51 | J9.SDA 11.08,33.48 13.4,35.8 13.4,35.9 | J8.SDA 15.2,22.08 15.2,23.8 | 15.2,23.8 15.2,34.5 13.8,35.9 13.4,35.9 | J7.SDA 24,13.39 24,18.7 22.2,18.7 17.1,23.8 15.2,23.8 | 13.4,36.7 13.4,35.9
  Bottom 0.203: 67.1,27.4 67.1,30.2 68.2,31.3 68.66,30.84 J4.SDA 72.34,30.84 75.6,34.1 75.6,36.5 72,40.1 67.9,40.1 67.6,40.4 67.6,44.5 | v64.7,27.7 65.9,26.5 66.2,26.5
  Bottom 0.254: 62.9,55.3 62.95,55.35 | 62.95,55.35 65.01,57.41 J2.SDA | 62.95,55.35 67.1,51.2 67.1,45 67.6,44.5 67.69,44.41 J3.SDA | 67.1,27.4 66.2,26.5 62.2,22.5 62.2,21.93 62.61,21.51 | 62.61,21.51 J5.SDA | 26.4,60.3 26.4,64.1 23.87,66.63 J12.SDA | 26.4,60.3 26.4,58.7 26.6,58.5 26.6,55.4 26.1,54.9 26.1,52.1 27.7,50.5 34.6,50.5 35.2,49.9 42.6,49.9 43.2,50.5 54.5,50.5 v60.5,56.5 | J6.SDA 56.74,9.4 59.6,9.4 62.8,12.6 62.8,14.3 60.3,16.8 60.3,18.9 62.61,21.21 62.61,21.51 | 13.4,36.7 11.71,38.4 11.71,46.51 14.51,46.51 v16.7,48.7 | v18.2,52.8 18.2,54.98 | 18.2,54.98 J11.SDA | 18.2,54.98 18.2,57 21.5,60.3 26.4,60.3
  Bottom 0.305: 62.95,55.35 61.65,55.35 v60.5,56.5 | v57.8,60.1 56.05,60.1 C15.2
TXD  (via drill 0.35)
  Top 0.254: R5.2 42.5,20.6 42.9,21 42.9,21.9 | 42.9,21.9 42.9,22 TP3.TP | U1.35 45.88,67.58 43.7,65.4 43.7,62.2 43.5,62 43.5,56.4 43.9,56 43.9,53.6 42.9,53.1 42.9,51.9 43.5,51.1 43.5,49.4 42.5,48.6 v42.5,46.7 | v44.2,26 43.7,25.5 43.7,22.7 42.9,21.9
  Bottom 0.254: v44.2,26 44.2,26.6 45,27.4 45,31.5 43.4,33.1 43.5,41.4 43.1,42.8 43.1,46 v42.5,46.7
TXLED  (via drill 0.35)
  Top 0.152: IC2.7 42.7,12.9 42.6,12.8 41.09,12.8 39.7,14.2 37.4,14.2 37,14.6 v37,15.1
  Top 0.254: R4.1 32.66,30.84 34,29.5 34,29.3 34.9,29.3 v35,29.2
  Bottom 0.254: v35,29.2 35.6,28.6 35.6,27.7 37,26.3 v37,15.1
USBDM  (via drill 0.35)
  Top 0.254: IC2.9 43.7,13.08 44.38,12.4 46.2,12.4 48.3,14.5 v48.3,16.6 | v39,13.4 40.5,11.9 40.5,11.4
  Top 0.305: USB1.2 39.4,5.57 39.4,8.9 40.5,10 40.5,11.4 40.9,11.8 41.4,11.8 41.4,11.2 D1.3
  Bottom 0.254: v48.3,16.6 46.9,16.6 43.7,13.4 v39,13.4
USBDP  (via drill 0.35)
  Top 0.152: IC2.8
  Top 0.305: D1.4 40.68,7.82 | 40.68,7.82 40.45,7.6 40.2,7.6 40.01,7.41 USB1.3 | IC2.8 43.2,12.89 44.4,11.7 45.7,11.7 46.3,11.1 v46.3,6.8 | v40.2,8.4 40.68,7.92 40.68,7.82
  Bottom 0.305: v46.3,6.8 44.8,8.3 40.3,8.3 v40.2,8.4
USBVBUS  (via drill 0.35)
  Top 0.305: D1.1 43.5,11 44.8,11 45,10.8 v45,6.7 | v37.1,7.8 38,8.7 38.4,8.7
  Top 0.508: USB1.1 38.7,8.1 | 38.7,8.1 38.7,8.39 38.4,8.7 37.7,9.4 U2.4 | U2.5 37.41,11.29 38.7,10 38.7,8.11 38.7,8.1
  Bottom 0.305: v37.1,7.8 37.4,7.5 44.2,7.5 v45,6.7
  pour Top: 34.9,7.4 38.7,7.4 38.7,9.3 39.6,10.2 39.6,11.9 39.2,12.3 35.6,12.3 35.4,12.1 35.4,10.2 34.9,9.7
VCCIO
  Top 0.254: TP7.TP 63.9,50.3 62.95,51.25 62.65,51.25
  Top 1.016: SJ1.1 60.85,46.38 63.72,46.38
  Top 1.27: C11.2 57.4,52.4 | 57.4,52.4 L1.2 | J2.VCC 63.8,57.81 63.8,52.4 62.65,51.25 61.4,50 | 61.4,50 57.6,50 57.6,52.2 57.4,52.4 | J3.VCC 63.72,46.38 | 61.4,50 61.4,48.7 63.72,46.38 | 63.72,46.38 63.72,37.52 | 63.72,37.52 63.72,37.02 | J4.VCC 68.44,32.76 63.7,37.5 | 63.7,37.5 63.72,37.52 | 63.7,37.5 62.7,36.5 62.7,33 60,30.3 60,26.93 63.17,23.77 | 63.17,23.77 J5.VCC | J6.VCC 55.1,13.76 55.1,15.8 55.2,15.8 63.17,23.77 | J7.VCC 26.6,13.27 | 26.6,13.27 26.6,13.3 | J8.VCC 17.12,21.2 19,21.2 | 26.6,13.27 24.5,15.37 24.5,15.7 19,21.2 | J9.VCC 10.94,31.54 11.5,32.1 | 11.5,32.1 18.9,24.7 18.9,21.3 19,21.2 | J10.VCC 10.77,44.53 13.8,41.5 | 13.8,41.5 13.8,34.4 11.5,32.1 | J11.VCC 15.4,55 | 13.8,41.5 15.4,43.1 15.4,46.5 | 15.4,55 15.4,46.5 | J12.VCC 22.9,64.4 22.9,62.6 15.4,55.1 15.4,55 | U$2.PLUS 15.4,46.5
  Bottom 0.406: C17.2 67.8,59.5 65.49,59.5 J2.VCC
  Bottom 1.27: J1.VCC 55.3,66.24 55.3,64.4 61.7,58 63.99,58 J2.VCC | J6.VCC 54.77,14.09 54.77,14.5 54.2,15.07 53.4,15.07 51.22,12.88 48.09,12.88 44.9,9.7 32.9,9.7 29.2,6 25.6,6 24.5,7.1 24.5,10.6 25.43,11.53 J7.VCC

### Text on the board
tPlace: 3V3
bPlace: MADE IN JAPAN | ESP32 WROVER DevBoard | Rev.0.4